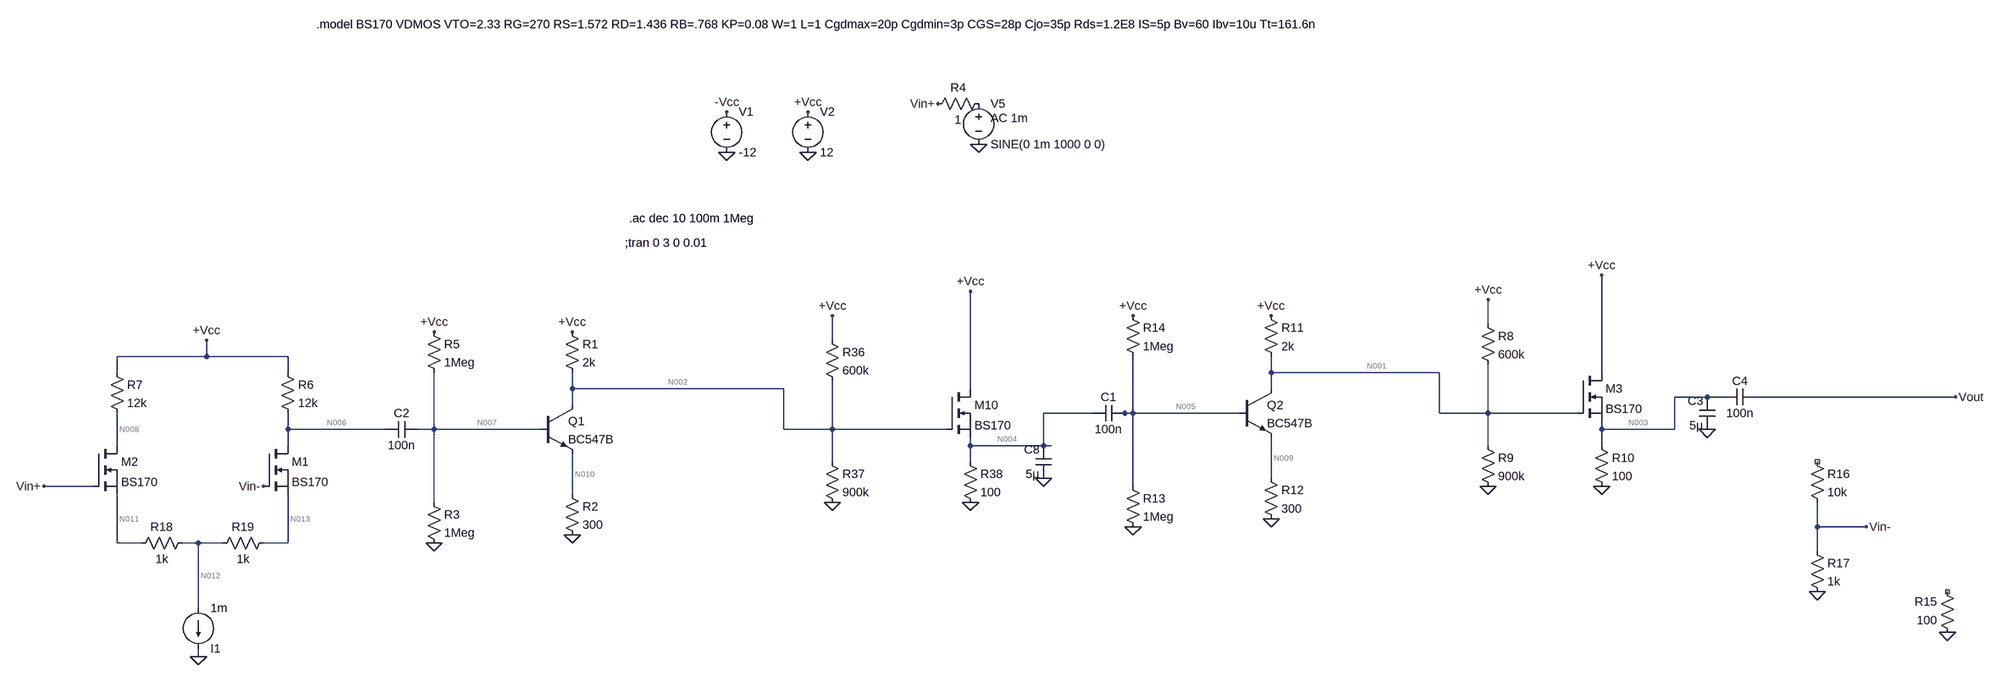
[diagram p0: schematic v4.asc]
v4.asc, the LTspice schematic file:
Version 4
SHEET 1 4084 732
WIRE 768 -1392 768 -1440
WIRE -608 -1360 -608 -1408
WIRE -1840 -1328 -1840 -1360
WIRE -1840 -1328 -2016 -1328
WIRE -1680 -1328 -1840 -1328
WIRE -2016 -1296 -2016 -1328
WIRE -1680 -1296 -1680 -1328
WIRE 256 -1296 256 -1328
WIRE 672 -1296 256 -1296
WIRE 1040 -1296 1040 -1488
WIRE -1120 -1264 -1120 -1296
WIRE -704 -1264 -1120 -1264
WIRE -336 -1264 -336 -1456
WIRE 256 -1264 256 -1296
WIRE 1248 -1248 1184 -1248
WIRE 1280 -1248 1248 -1248
WIRE 1760 -1248 1344 -1248
WIRE -1120 -1232 -1120 -1264
WIRE -96 -1216 -192 -1216
WIRE -32 -1216 -48 -1216
WIRE -16 -1216 -16 -1328
WIRE -16 -1216 -32 -1216
WIRE 192 -1216 -16 -1216
WIRE 672 -1216 672 -1296
WIRE 768 -1216 768 -1312
WIRE 768 -1216 672 -1216
WIRE 992 -1216 768 -1216
WIRE -1680 -1184 -1680 -1216
WIRE -1488 -1184 -1680 -1184
WIRE -1392 -1184 -1392 -1296
WIRE -1392 -1184 -1424 -1184
WIRE -1184 -1184 -1392 -1184
WIRE -704 -1184 -704 -1264
WIRE -608 -1184 -608 -1280
WIRE -608 -1184 -704 -1184
WIRE -384 -1184 -608 -1184
WIRE 1040 -1184 1040 -1200
WIRE 1184 -1184 1184 -1248
WIRE 1184 -1184 1040 -1184
WIRE -2016 -1152 -2016 -1216
WIRE -1680 -1152 -1680 -1184
WIRE -336 -1152 -336 -1168
WIRE -192 -1152 -192 -1216
WIRE -192 -1152 -336 -1152
WIRE -176 -1152 -192 -1152
WIRE 768 -1152 768 -1216
WIRE 1040 -1152 1040 -1184
WIRE -608 -1120 -608 -1184
WIRE -336 -1120 -336 -1152
WIRE 256 -1088 256 -1168
WIRE -2064 -1072 -2160 -1072
WIRE -16 -1072 -16 -1216
WIRE -1120 -1056 -1120 -1136
WIRE -1392 -1040 -1392 -1184
WIRE 1488 -992 1488 -1040
WIRE 1584 -992 1488 -992
WIRE -2016 -960 -2016 -1056
WIRE -1968 -960 -2016 -960
WIRE -1856 -960 -1888 -960
WIRE -1808 -960 -1856 -960
WIRE -1680 -960 -1680 -1056
WIRE -1680 -960 -1728 -960
WIRE 1488 -944 1488 -992
WIRE -1856 -832 -1856 -960
WIRE -1856 -736 -1856 -752
FLAG -816 -1760 0
FLAG -656 -1760 0
FLAG -816 -1840 -Vcc
FLAG -656 -1840 +Vcc
FLAG -320 -1776 0
FLAG -400 -1856 Vin+
FLAG -608 -1408 +Vcc
FLAG -336 -1456 +Vcc
FLAG -1120 -976 0
FLAG -1392 -960 0
FLAG -1392 -1376 +Vcc
FLAG -1120 -1376 +Vcc
FLAG -336 -1040 0
FLAG -608 -1040 0
FLAG -1840 -1360 +Vcc
FLAG -1856 -736 0
FLAG -1728 -1072 Vin-
FLAG 768 -1440 +Vcc
FLAG 1040 -1488 +Vcc
FLAG 256 -1008 0
FLAG -16 -992 0
FLAG -16 -1408 +Vcc
FLAG 256 -1408 +Vcc
FLAG 1040 -1072 0
FLAG 768 -1072 0
FLAG 1744 -784 0
FLAG 1488 -864 0
FLAG -2160 -1072 Vin+
FLAG 1584 -992 Vin-
FLAG 1760 -1248 Vout
FLAG -192 -1088 0
FLAG 1248 -1184 0
SYMBOL voltage -816 -1856 R0
WINDOW 123 0 0 Left 0
WINDOW 39 0 0 Left 0
SYMATTR InstName V1
SYMATTR Value -12
SYMBOL voltage -656 -1856 R0
WINDOW 123 0 0 Left 0
WINDOW 39 0 0 Left 0
SYMATTR InstName V2
SYMATTR Value 12
SYMBOL voltage -320 -1872 R0
WINDOW 123 24 44 Left 2
WINDOW 39 0 0 Left 0
SYMATTR Value2 AC 1m
SYMATTR InstName V5
SYMATTR Value SINE(0 1m 1000 0 0)
SYMBOL res -304 -1872 R90
WINDOW 0 0 56 VBottom 2
WINDOW 3 32 56 VTop 2
SYMATTR InstName R4
SYMATTR Value 1
SYMBOL nmos -384 -1264 R0
SYMATTR InstName M10
SYMATTR Value BS170
SYMBOL res -624 -1376 R0
SYMATTR InstName R36
SYMATTR Value 600k
SYMBOL res -624 -1136 R0
SYMATTR InstName R37
SYMATTR Value 900k
SYMBOL res -352 -1136 R0
SYMATTR InstName R38
SYMATTR Value 100
SYMBOL npn -1184 -1232 R0
SYMATTR InstName Q1
SYMATTR Value BC547B
SYMBOL res -1136 -1392 R0
SYMATTR InstName R1
SYMATTR Value 2k
SYMBOL res -1136 -1072 R0
SYMATTR InstName R2
SYMATTR Value 300
SYMBOL res -1408 -1056 R0
SYMATTR InstName R3
SYMATTR Value 1Meg
SYMBOL res -1408 -1392 R0
SYMATTR InstName R5
SYMATTR Value 1Meg
SYMBOL cap -32 -1232 R90
WINDOW 0 0 32 VBottom 2
WINDOW 3 32 32 VTop 2
SYMATTR InstName C1
SYMATTR Value 100n
SYMBOL nmos -2064 -1152 R0
SYMATTR InstName M2
SYMATTR Value BS170
SYMBOL res -1696 -1312 R0
SYMATTR InstName R6
SYMATTR Value 12k
SYMBOL res -2032 -1312 R0
SYMATTR InstName R7
SYMATTR Value 12k
SYMBOL current -1856 -832 R0
WINDOW 0 24 80 Left 2
WINDOW 3 24 0 Left 2
WINDOW 123 0 0 Left 0
WINDOW 39 0 0 Left 0
SYMATTR InstName I1
SYMATTR Value 1m
SYMBOL nmos -1728 -1152 R0
SYMATTR InstName M1
SYMATTR Value BS170
SYMBOL cap -1424 -1200 R90
WINDOW 0 0 32 VBottom 2
WINDOW 3 32 32 VTop 2
SYMATTR InstName C2
SYMATTR Value 100n
SYMBOL nmos 992 -1296 R0
SYMATTR InstName M3
SYMATTR Value BS170
SYMBOL res 752 -1408 R0
SYMATTR InstName R8
SYMATTR Value 600k
SYMBOL res 752 -1168 R0
SYMATTR InstName R9
SYMATTR Value 900k
SYMBOL res 1024 -1168 R0
SYMATTR InstName R10
SYMATTR Value 100
SYMBOL npn 192 -1264 R0
SYMATTR InstName Q2
SYMATTR Value BC547B
SYMBOL res 240 -1424 R0
SYMATTR InstName R11
SYMATTR Value 2k
SYMBOL res 240 -1104 R0
SYMATTR InstName R12
SYMATTR Value 300
SYMBOL res -32 -1088 R0
SYMATTR InstName R13
SYMATTR Value 1Meg
SYMBOL res -32 -1424 R0
SYMATTR InstName R14
SYMATTR Value 1Meg
SYMBOL cap 1344 -1264 R90
WINDOW 0 0 32 VBottom 2
WINDOW 3 32 32 VTop 2
SYMATTR InstName C4
SYMATTR Value 100n
SYMBOL res 1760 -768 R180
WINDOW 0 36 76 Left 2
WINDOW 3 36 40 Left 2
SYMATTR InstName R15
SYMATTR Value 100
SYMBOL res 1472 -1136 R0
SYMATTR InstName R16
SYMATTR Value 10k
SYMBOL res 1472 -960 R0
SYMATTR InstName R17
SYMATTR Value 1k
SYMBOL res -1872 -976 R90
WINDOW 0 0 56 VBottom 2
WINDOW 3 32 56 VTop 2
SYMATTR InstName R18
SYMATTR Value 1k
SYMBOL res -1712 -976 R90
WINDOW 0 0 56 VBottom 2
WINDOW 3 32 56 VTop 2
SYMATTR InstName R19
SYMATTR Value 1k
SYMBOL cap -176 -1088 R180
WINDOW 0 24 56 Left 2
WINDOW 3 24 8 Left 2
SYMATTR InstName C8
SYMATTR Value 5µ
SYMBOL cap 1264 -1184 R180
WINDOW 0 24 56 Left 2
WINDOW 3 24 8 Left 2
SYMATTR InstName C3
SYMATTR Value 5µ
TEXT -1016 -1552 Left 2 !;tran 0 3 0 0.01
TEXT -1624 -2048 Left 2 !.model BS170 VDMOS VTO=2.33 RG=270 RS=1.572 RD=1.436 RB=.768 KP=0.08 W=1 L=1 Cgdmax=20p Cgdmin=3p CGS=28p Cjo=35p Rds=1.2E8 IS=5p Bv=60 Ibv=10u Tt=161.6n
TEXT -1008 -1600 Left 2 !.ac dec 10 100m 1Meg

The netlist it stands for:
* v4.asc
V1 -Vcc 0 -12
V2 +Vcc 0 12
V5 P001 0 SINE(0 1m 1000 0 0) AC 1m
R4 P001 Vin+ 1
M10 +Vcc N002 N004 N004 BS170
R36 +Vcc N002 600k
R37 N002 0 900k
R38 N004 0 100
Q1 N002 N007 N010 0 BC547B
R1 +Vcc N002 2k
R2 N010 0 300
R3 N007 0 1Meg
R5 +Vcc N007 1Meg
C1 N005 N004 100n
M2 N008 Vin+ N011 N011 BS170
R6 +Vcc N006 12k
R7 +Vcc N008 12k
I1 N012 0 1m
M1 N006 Vin- N013 N013 BS170
C2 N007 N006 100n
M3 +Vcc N001 N003 N003 BS170
R8 +Vcc N001 600k
R9 N001 0 900k
R10 N003 0 100
Q2 N001 N005 N009 0 BC547B
R11 +Vcc N001 2k
R12 N009 0 300
R13 N005 0 1Meg
R14 +Vcc N005 1Meg
C4 Vout N003 100n
R15 0 NC_01 100
R16 NC_02 Vin- 10k
R17 Vin- 0 1k
R18 N012 N011 1k
R19 N013 N012 1k
C8 0 N004 5µ
C3 0 N003 5µ
.model NPN NPN
.model PNP PNP
.lib standard.bjt
.model NMOS NMOS
.model PMOS PMOS
.lib standard.mos
;tran 0 3 0 0.01
.model BS170 VDMOS VTO=2.33 RG=270 RS=1.572 RD=1.436 RB=.768 KP=0.08 W=1 L=1 Cgdmax=20p Cgdmin=3p CGS=28p Cjo=35p Rds=1.2E8 IS=5p Bv=60 Ibv=10u Tt=161.6n
.ac dec 10 100m 1Meg
.backanno
.end

* Results of the author's LTspice run, read from the files saved beside the schematic
* Operating Point, zero values left out:
*   V(-vcc) = -12 V
*   V(+vcc) = 12 V
*   V(n002) = 6.542 V
*   V(n004) = 3.258 V
*   V(n007) = 1.486 V
*   V(n010) = 821.9 mV
*   V(n005) = 1.486 V
*   V(n008) = 6 V
*   V(n011) = -2.443 V
*   V(n006) = 6 V
*   V(n012) = -2.943 V
*   V(n013) = -2.443 V
*   V(n001) = 6.542 V
*   V(n003) = 3.258 V
*   V(n009) = 821.9 mV
*   V(vout) = 325.8 nV
*   Ic(Q2) = 2.731 mA
*   Ib(Q2) = 9.028 µA
*   Ie(Q2) = -2.74 mA
*   Ic(Q1) = 2.731 mA
*   Ib(Q1) = 9.028 µA
*   Ie(Q1) = -2.74 mA
*   Id(M3) = 32.58 mA
*   Ig(M3) = -4.208 pA
*   Is(M3) = -32.58 mA
*   Id(M1) = 500 µA
*   Ig(M1) = -4.092 pA
*   Is(M1) = -500 µA
*   Id(M2) = 500 µA
*   Ig(M2) = -4.092 pA
*   Is(M2) = -500 µA
*   Id(M10) = 32.58 mA
*   Ig(M10) = -4.208 pA
*   Is(M10) = -32.58 mA
*   I(I1) = 1 mA
*   I(R19) = 500 µA
*   I(R18) = -500 µA
*   I(R14) = 10.51 µA
*   I(R13) = 1.486 µA
*   I(R12) = 2.74 mA
*   I(R11) = 2.729 mA
*   I(R10) = 32.58 mA
*   I(R9) = 7.269 µA
*   I(R8) = 9.096 µA
*   I(R7) = 500 µA
*   I(R6) = 500 µA
*   I(R5) = 10.51 µA
*   I(R3) = 1.486 µA
*   I(R2) = 2.74 mA
*   I(R1) = 2.729 mA
*   I(R38) = 32.58 mA
*   I(R37) = 7.269 µA
*   I(R36) = 9.096 µA
*   I(V2) = -71.66 mA
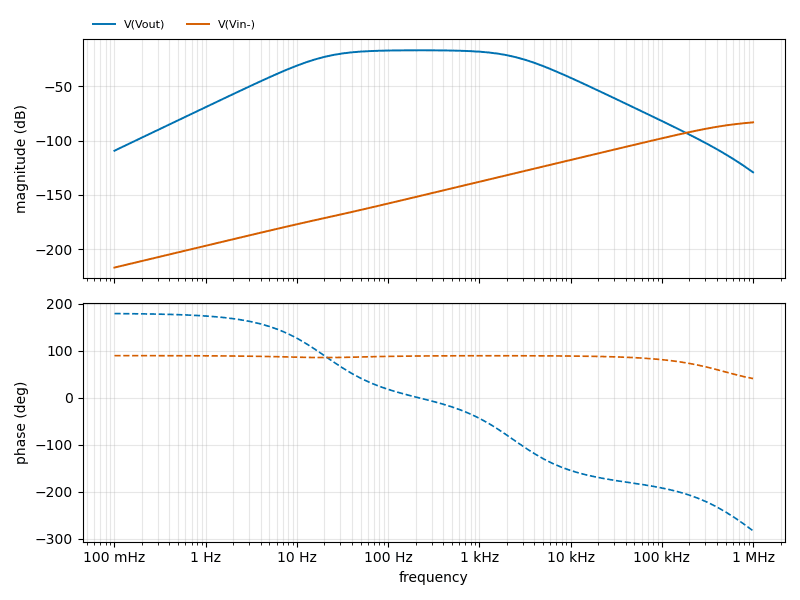
[diagram p1: AC Analysis of v4.asc, plotted from the saved traces]
* AC Analysis, 1 run:
*   V(Vout): -109.35 dB at 100 mHz, -129.18 dB at 1 MHz, peak -17.18 dB at 199.5 Hz, 3 dB below the peak at 30.91 Hz and 1.579 kHz
*   V(Vin-): -216.63 dB at 100 mHz, -83.33 dB at 1 MHz, peak -83.33 dB at 1 MHz, 3 dB below the peak at 484.4 kHz